# Altium project MAG_SENS.PrjPcb
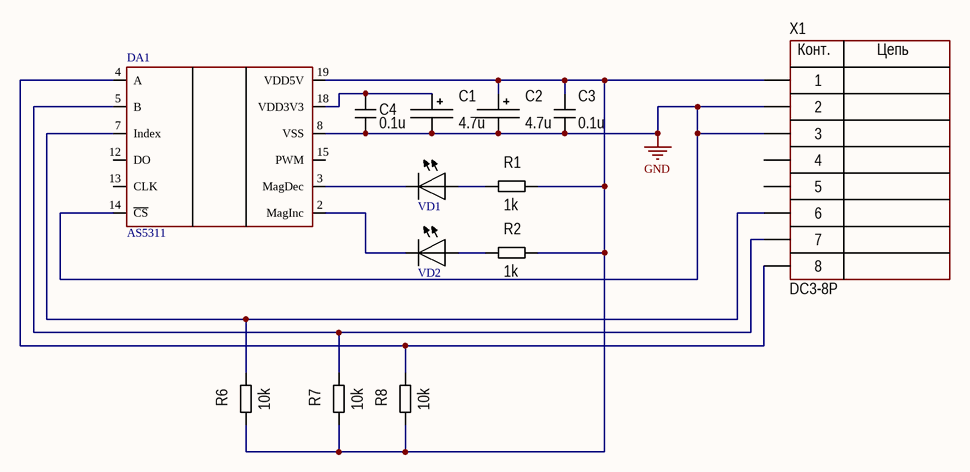
[diagram p0: Sheet1.SchDoc]
1 sheet, 13 parts. Net scope: global (net labels, ports and power ports of the same name join across sheets).
Board file: PCB1.PcbDoc

## Sheet Sheet1.SchDoc
size 414 x 293 mm; SheetNumber: 1; SheetTotal: 1

### Parts
C1  4.7u  [TANTAL_A]
C2  4.7u  [TANTAL_A]
C3  0.1u  [CH0603C]
C4  0.1u  [CH0805C]
DA1  AS5311  [20-TSSOP]
R1  1k  [CH0402R]
R2  1k  [CH0402R]
R6  10k  [CH0402R]
R7  10k  [CH0402R]
R8  10k  [CH0402R]
VD1  LED  [VD_0603]  (value not drawn)
VD2  LED  [VD_0603]  (value not drawn)
X1  DC3-8P  [CON: DC3 2x4P]

### Nets
GND: C1.2 C2.2 C3.1 C4.1 DA1.8(VSS) DA1.14(~{CS}) X1.2 X1.3
NetC1_1: C1.1 C4.2 DA1.18(VDD3V3)
NetC2_1: C2.1 C3.2 DA1.19(VDD5V) R1.2 R2.2 R6.1 R7.1 R8.1 X1.1
NetDA1_2: DA1.2(MagInc) VD2.2
NetDA1_3: DA1.3(MagDec) VD1.2
NetDA1_4: DA1.4(A) R8.2 X1.8
NetDA1_5: DA1.5(B) R7.2 X1.7
NetDA1_7: DA1.7(Index) R6.2 X1.6
NetR1_1: R1.1 VD1.1
NetR2_1: R2.1 VD2.1

Not connected (* = marked no-connect by the designer): DA1 12(DO) 13(CLK) 15(PWM); X1 4 5

### Notes on the sheet
- Изм.
- Лист
- № докум.
- Подпись
- Дата
- Лит.
- Масса
- Масштаб
- Пров.
- Разраб.
- Т. контр.
- Н. контр.
- Листов
- Утв.
- (in symbol 8-Connector) Конт.; Цепь

### Library data of the parts
C1 C2 = TantalCap: Manufacturer: 10u; Model: TAJA475M010RNJ; HelpURL: *; ComponentKind: *; Value: 4.7u
C3 = Capacitor: Model: 06035C104JAT2A; Manufacturer: *; HelpURL: *; ComponentKind: *; Value: 0.1u
C4 = Capacitor: Model: 08055C104JAT2A; Manufacturer: *; HelpURL: *; ComponentKind: *; Value: 0.1u
DA1 = AS5311: Model: AS5311-ATST
R1 R2 = Resistor: Model: CR0402-JW-102GLF; Manufacturer: *; HelpURL: *; ComponentKind: *; Value: 1k
R6-R8 = Resistor: Model: CR0402-JW-103GLF; Manufacturer: *; HelpURL: *; ComponentKind: *; Value: 10k
VD1 = LED: Model: KPT-1608SGC
VD2 = LED: Model: KPT-1608YC
X1 = 8-Connector: Model: DC3-8P; Manufacturer: *; HelpURL: *; ComponentKind: *